# EAGLE design XBeePowerMod (EAGLE 6.4)
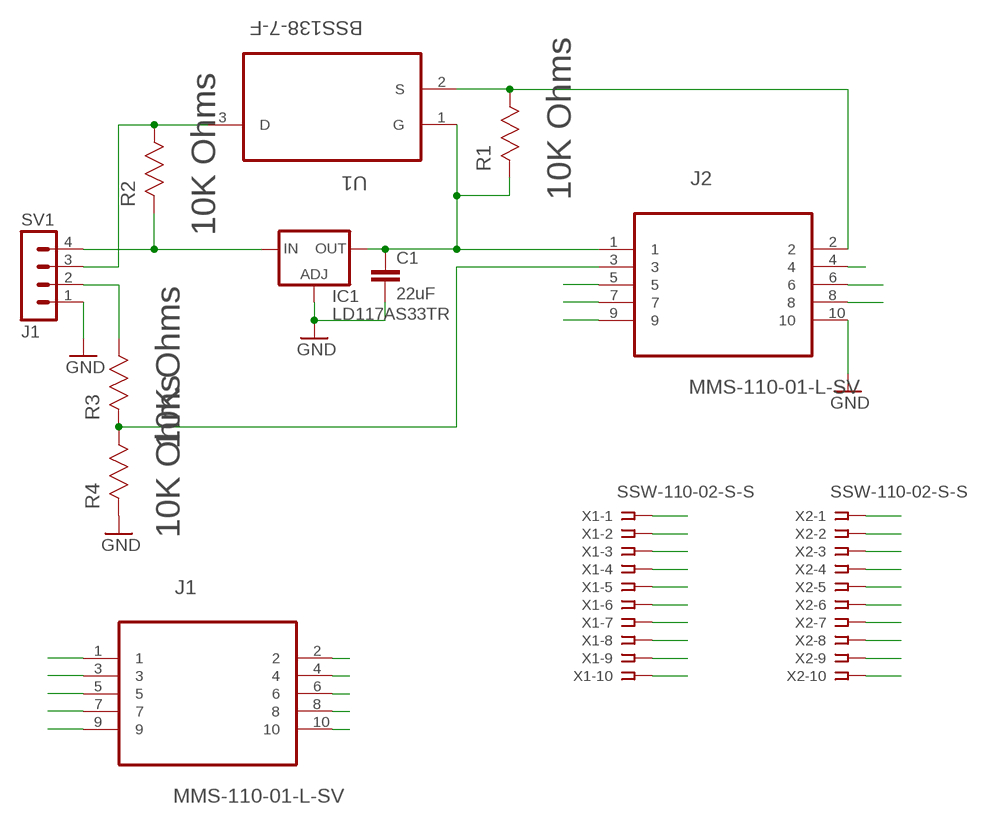
[diagram p0: schematic, sheet 1]

## Parts
C1  22uF  C-EUC1206K  [C1206K]
IC1  LD117AS33TR  [SOT223]
J1  MMS-110-01-L-SV  [SAMTEC_MMS-110-01-L-SV]
J2  MMS-110-01-L-SV  [SAMTEC_MMS-110-01-L-SV]
R1  10K Ohms  MC0.125W12061%10K  [RESC3216X71N]
R2  10K Ohms  MC0.125W12061%10K  [RESC3216X71N]
R3  10K Ohms  MC0.125W12061%10K  [RESC3216X71N]
R4  10K Ohms  MC0.125W12061%10K  [RESC3216X71N]
SV1  J1  MA04-1  [MA04-1]
U1  BSS138-7-F  [SOT95P240X110-3N]
X1  SSW-110-02-S-S  [SSW-110-02-S-S]
X2  SSW-110-02-S-S  [SSW-110-02-S-S]

## Nets
GND: C1.2 IC1.1(ADJ) J2.10 R4.2(R2) SV1.1 X2.10
N$1: IC1.3(IN) R2.2(R2) SV1.4
N$3: R3.1(R1) SV1.2
N$4: R2.1(R1) SV1.3 U1.3(D)
X10: J1.10 X1.10
X11: J1.1 X1.1
X12: J1.2 X1.2
X13: J1.3 X1.3
X14: J1.4 X1.4
X15: J1.5 X1.5
X16: J1.6 X1.6
X17: J1.7 X1.7
X18: J1.8 X1.8
X19: J1.9 X1.9
X21: C1.1 IC1.4(OUT) J2.1 R1.2(R2) U1.1(G) X2.1
X22: J2.2 R1.1(R1) U1.2(S) X2.2
X23: J2.3 R3.2(R2) R4.1(R1) X2.3
X24: J2.4 X2.4
X25: J2.5 X2.5
X26: J2.6 X2.6
X27: J2.7 X2.7
X28: J2.8 X2.8
X29: J2.9 X2.9

## Library data of the parts
C1 = rcl:C-EU: CAPACITOR, European symbol
IC1 = v-reg:LD117A?*: Low drop fixed and adjustable positive voltage regulators 1 A Source: http://www.st.com/stonline/products/literature/ds/7194/ld1117axx.pdf
J1 J2 = SAMTEC-FLE-Mxx-Sxx_By_element14_Batch_1:MMS-110-01-L-SV: CONN SOCKET, 2.0MM, VERT, 1X10WAY; MPN: MMS-110-01-L-SV; OC_FARNELL: 1885919; OC_NEWARK: 96M0485; PACKAGE: SOCKET, 2.0MM, VERT, 1X10WAY; SUPPLIER: Samtec
R1-R4 = Multicomp_By_element14_Batch_1:MC0.125W12061%10K: RESISTOR, 1206; MPN: MC0.125W12061%10K; OC_FARNELL: 9335765; OC_NEWARK: 39K0872; SUPPLIER: Multicomp; TOLERANCE: ±1%; WATTAGE: 1/8 W
SV1 = con-lstb:MA04-1: PIN HEADER; OC_FARNELL: unknown; OC_NEWARK: unknown
U1 = Diodes_Inc_By_element14_Batch_1:BSS138-7-F: ENHANCEMENT MODE MOSFET; MPN: BSS138-7-F; OC_FARNELL: 1843693; OC_NEWARK: 12T1442; PACKAGE: SOT-23-3; SUPPLIER: DIODES INC.
X1 X2 = con-samtec:SSW-110-02-S-S: THROUGH-HOLE .025" SQ POST SOCKET Source: Samtec SSW.pdf; MPN: SSW-110-02-S-S; OC_FARNELL: unknown; OC_NEWARK: 11P9482

## Board
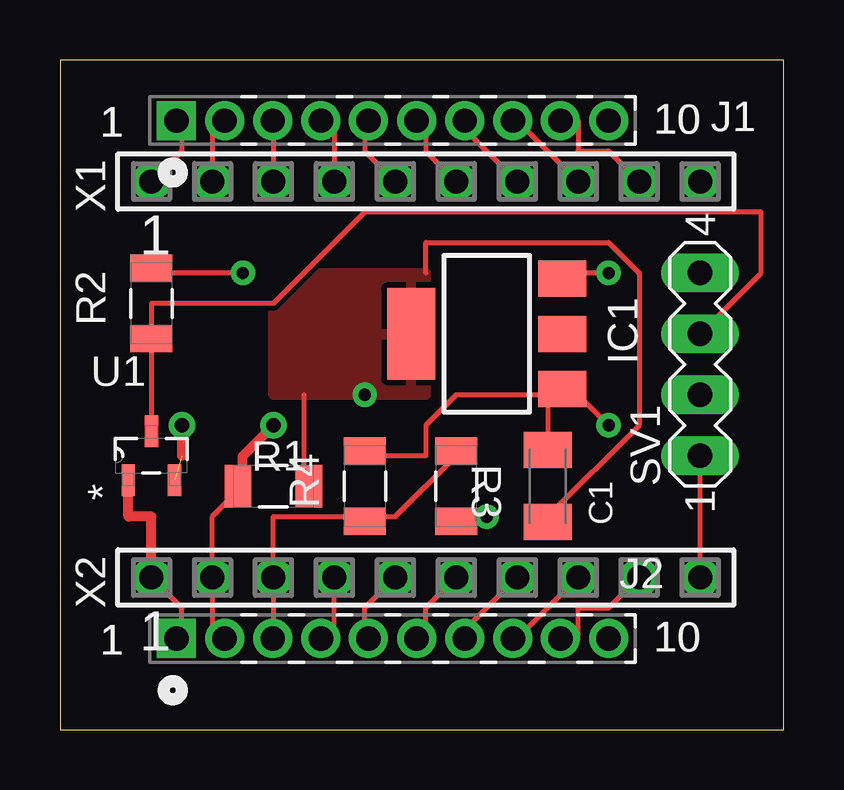
[diagram p1: board, top side]
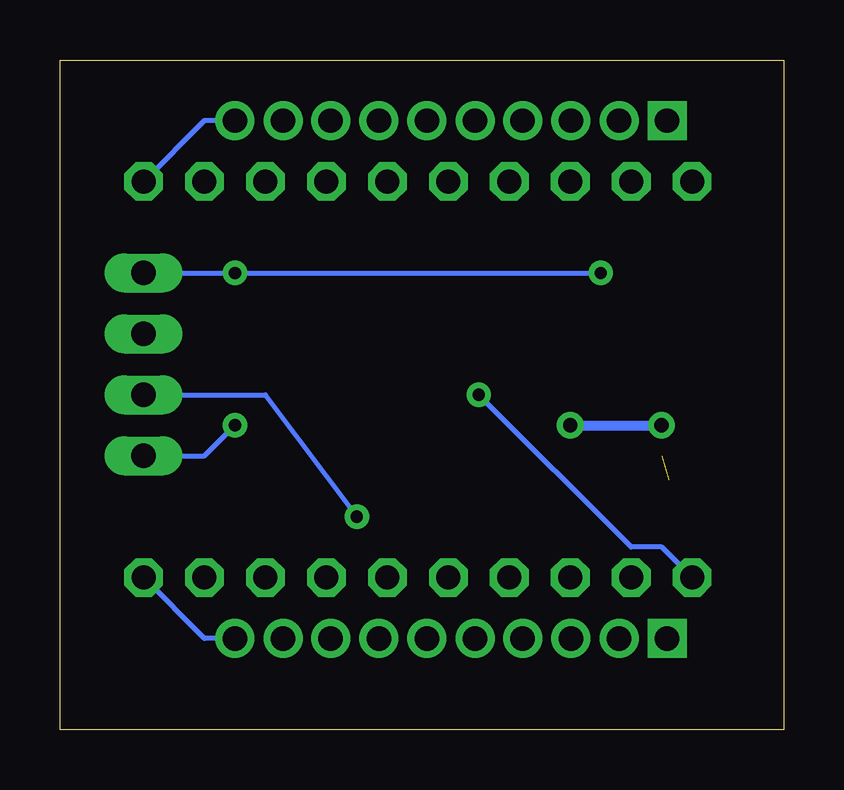
[diagram p2: board, bottom side, seen from below]

Size 30.15 x 27.93 mm. Coordinates in mm from the lower left corner, seen from the top.
Outline: 0,0 30.15,0 30.15,27.93 0,27.93 0,0
Copper layers (1*16): Top 0.035mm / dielectric 1.5mm / Bottom 0.035mm
Design rules "SparkFun": minimum track width 8mil, minimum drill 20mil, track to track 8mil, track to pad 8mil, pad to pad 8mil, via to via 8mil, smd to smd 8mil, copper to edge 10mil, drill to drill 8mil, minimum pad ring 12mil, minimum via ring 10mil, stop-mask expansion 4mil, vias tented up to drill 25mil, thermal gap 10mil

### Footprints (pad centres in the part's own frame; a part is rotated, then mirrored left to right if it is on the bottom)
C1206K = smd 1.5 x 2: 1 -1.5,0; 2 1.5,0
SOT223 = smd 1.5 x 2: 1 -2.3,-3.15; 2 0,-3.15; 3 2.3,-3.15 | smd 3.8 x 2: 4 0,3.15
SAMTEC_MMS-110-01-L-SV = drill 1.016 square: 1 -18.009,0 | drill 1.016: 2 -16.002,0; 3 -13.995,0; 4 -11.989,0; 5 -10.008,0; 6 -8.001,0; 7 -5.994,0; 8 -3.988,0; 9 -2.007,0; 10 0,0
RESC3216X71N = smd 1.118 x 1.753: 1 -1.473,0; 2 1.473,0
MA04-1 = drill 1.016 long: 1 -3.81,0; 2 -1.27,0; 3 1.27,0; 4 3.81,0
SOT95P240X110-3N = smd 1.321 x 0.559: 1 -1.016,0.965; 2 -1.016,-0.965; 3 1.016,0
SSW-110-02-S-S = drill 1 pad 1.5 octagon: 1 -11.43,0; 2 -8.89,0; 3 -6.35,0; 4 -3.81,0; 5 -1.27,0; 6 1.27,0; 7 3.81,0; 8 6.35,0; 9 8.89,0; 10 11.43,0

### Placement (x,y rotation side)
C1  20.32,10.16 90 top
IC1  17.78,16.51 90 top
J1  22.86,25.4 0 top
J2  22.86,3.81 0 top
R1  8.89,10.16 0 top
R2  3.81,17.78 90 top
R3  16.51,10.16 90 top
R4  12.7,10.16 90 top
SV1  26.67,15.24 90 top
U1  3.81,11.43 90 top
X1  15.24,22.86 0 top
X2  15.24,6.35 0 top

### Tracks (layer width: path | path; a pad name or v marks a point on that pad's centre or on a via)
GND  (via drill 0.51)
  Top 0.203: 20.32,13.97 16.51,13.97 15.24,12.7 15.24,11.43 12.7,11.43 R4.2 | 20.32,13.97 C1.2 20.32,11.43 | 20.32,13.97 IC1.1 21.59,13.97 v22.86,12.7 | X2.10 SV1.1
  Bottom 0.203: X2.10 24.13,3.81 J2.10 | v22.86,12.7 24.13,11.43 SV1.1
N$1  (via drill 0.51)
  Top 0.203: v7.62,19.05 3.81,19.05 R2.2 | v22.86,19.05 21.59,19.05 IC1.3
  Bottom 0.203: SV1.4 v22.86,19.05 v7.62,19.05
N$3  (via drill 0.51)
  Top 0.203: v17.78,8.89 16.51,8.89 R3.1
  Bottom 0.203: v17.78,8.89 21.59,13.97 SV1.2
N$4
  Top 0.203: U1.3 R2.1 3.81,17.78 8.89,17.78 12.7,21.59 29.21,21.59 29.21,19.05 SV1.3
X10
  Bottom 0.203: X1.10 24.13,25.4 J1.10
X11
  Top 0.203: X1.1 5.08,24.13 5.08,25.4 J1.1
X12
  Top 0.203: X1.2 6.35,25.4 J1.2
X13
  Top 0.203: X1.3 8.89,25.4 J1.3
X14
  Top 0.203: X1.4 11.43,25.4 J1.4
X15
  Top 0.203: X1.5 12.7,24.13 12.7,25.4 J1.5
X16
  Top 0.203: X1.6 15.24,24.13 15.24,25.4 J1.6
X17
  Top 0.203: X1.7 16.51,25.4 J1.7
X18
  Top 0.203: X1.8 19.05,25.4 J1.8
X19
  Top 0.203: X1.9 22.86,24.13 21.59,24.13 21.59,25.4 J1.9
X21  (via drill 0.51)
  Top 0.203: X2.1 5.08,5.08 5.08,3.81 J2.1 | 15.24,19.05 15.24,20.32 22.86,20.32 24.13,19.05 24.13,12.7 20.32,8.89 C1.1 | 10.16,13.97 10.16,10.16 R1.2
  Top 0.406: X2.1 3.81,8.89 2.85,8.89 U1.1
  Bottom 0.203: v12.7,13.97 6.35,7.62 5.08,7.62 X2.1
  pour Top: 8.89,19.05 15.24,19.05 15.24,13.97 8.89,13.97
X22  (via drill 0.6)  (1 unrouted)
  Top 0.203: 7.62,10.16 6.35,8.89 X2.2 6.35,3.81 J2.2
  Top 0.406: v5.08,12.7 5.08,11.43 | v8.89,12.7 7.62,11.43 7.62,10.16 R1.1
  Bottom 0.406: v8.89,12.7 v5.08,12.7
X23
  Top 0.203: 12.7,8.89 8.89,8.89 X2.3 8.89,3.81 J2.3 | 12.7,8.89 13.97,8.89 16.51,11.43 R3.2 | 12.7,8.89 R4.1
X24
  Top 0.203: X2.4 11.43,3.81 J2.4
X25
  Top 0.203: X2.5 12.7,5.08 12.7,3.81 J2.5
X26
  Top 0.203: X2.6 15.24,5.08 15.24,3.81 J2.6
X27
  Top 0.203: X2.7 16.51,3.81 J2.7
X28
  Top 0.203: X2.8 19.05,3.81 J2.8
X29
  Top 0.203: X2.9 22.86,5.08 21.59,5.08 21.59,3.81 J2.9